# EAGLE design dot-reader (EAGLE 7.3.0)
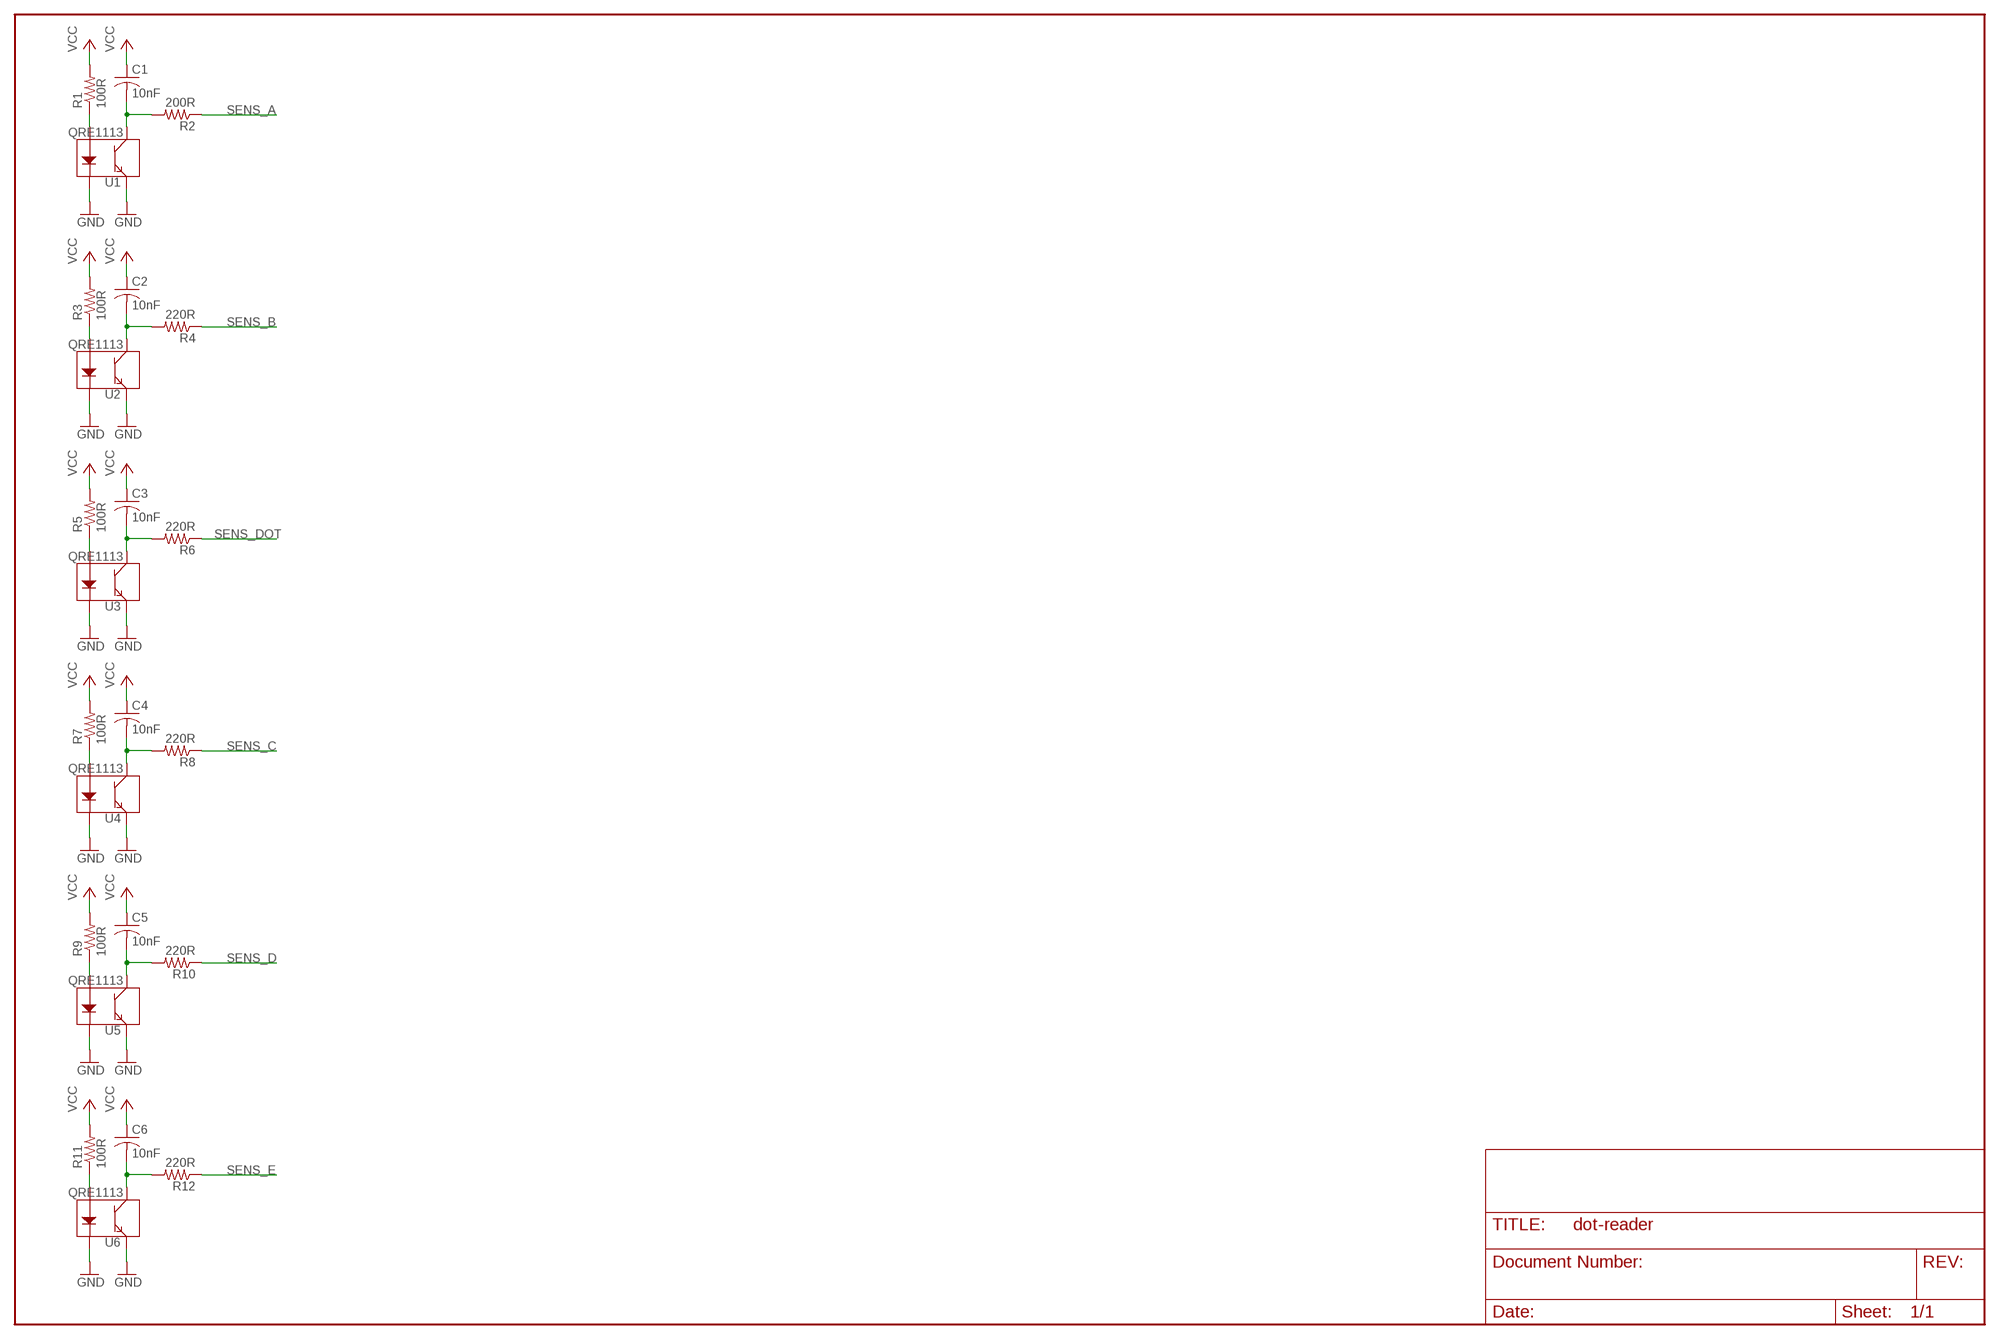
[diagram p0: schematic, sheet 1]

## Parts
C1  10nF  C-USC0805  [C0805]
C2  10nF  C-USC0805  [C0805]
C3  10nF  C-USC0805  [C0805]
C4  10nF  C-USC0805  [C0805]
C5  10nF  C-USC0805  [C0805]
C6  10nF  C-USC0805  [C0805]
R1  100R  R-US_M0805  [M0805]
R2  200R  R-US_M0805  [M0805]
R3  100R  R-US_M0805  [M0805]
R4  220R  R-US_M0805  [M0805]
R5  100R  R-US_M0805  [M0805]
R6  220R  R-US_M0805  [M0805]
R7  100R  R-US_M0805  [M0805]
R8  220R  R-US_M0805  [M0805]
R9  100R  R-US_M0805  [M0805]
R10  220R  R-US_M0805  [M0805]
R11  100R  R-US_M0805  [M0805]
R12  220R  R-US_M0805  [M0805]
U1  QRE1113  [QRE1113]
U2  QRE1113  [QRE1113]
U3  QRE1113  [QRE1113]
U4  QRE1113  [QRE1113]
U5  QRE1113  [QRE1113]
U6  QRE1113  [QRE1113]

## Nets
GND: U1.2(K) U1.4(E) U2.2(K) U2.4(E) U3.2(K) U3.4(E) U4.2(K) U4.4(E) U5.2(K) U5.4(E) U6.2(K) U6.4(E)
N$1: R1.1 U1.1(A)
N$2: C1.2 R2.2 U1.3(C)
N$3: R3.1 U2.1(A)
N$4: C2.2 R4.2 U2.3(C)
N$5: R5.1 U3.1(A)
N$6: C3.2 R6.2 U3.3(C)
N$7: R7.1 U4.1(A)
N$8: C4.2 R8.2 U4.3(C)
N$9: R9.1 U5.1(A)
N$10: C5.2 R10.2 U5.3(C)
N$11: R11.1 U6.1(A)
N$12: C6.2 R12.2 U6.3(C)
SENS_A: R2.1
SENS_B: R4.1
SENS_C: R8.1
SENS_D: R10.1
SENS_DOT: R6.1
SENS_E: R12.1
VCC: C1.1 C2.1 C3.1 C4.1 C5.1 C6.1 R1.2 R3.2 R5.2 R7.2 R9.2 R11.2

## Library data of the parts
C1-C6 = resistor:C-US: CAPACITOR, American symbol
R1-R12 = resistor:R-US_: RESISTOR, American symbol
U1-U6 = SparkFun-Sensors:QRE1113: Reflective object sensor; PROD_ID: IC-09357

## Board
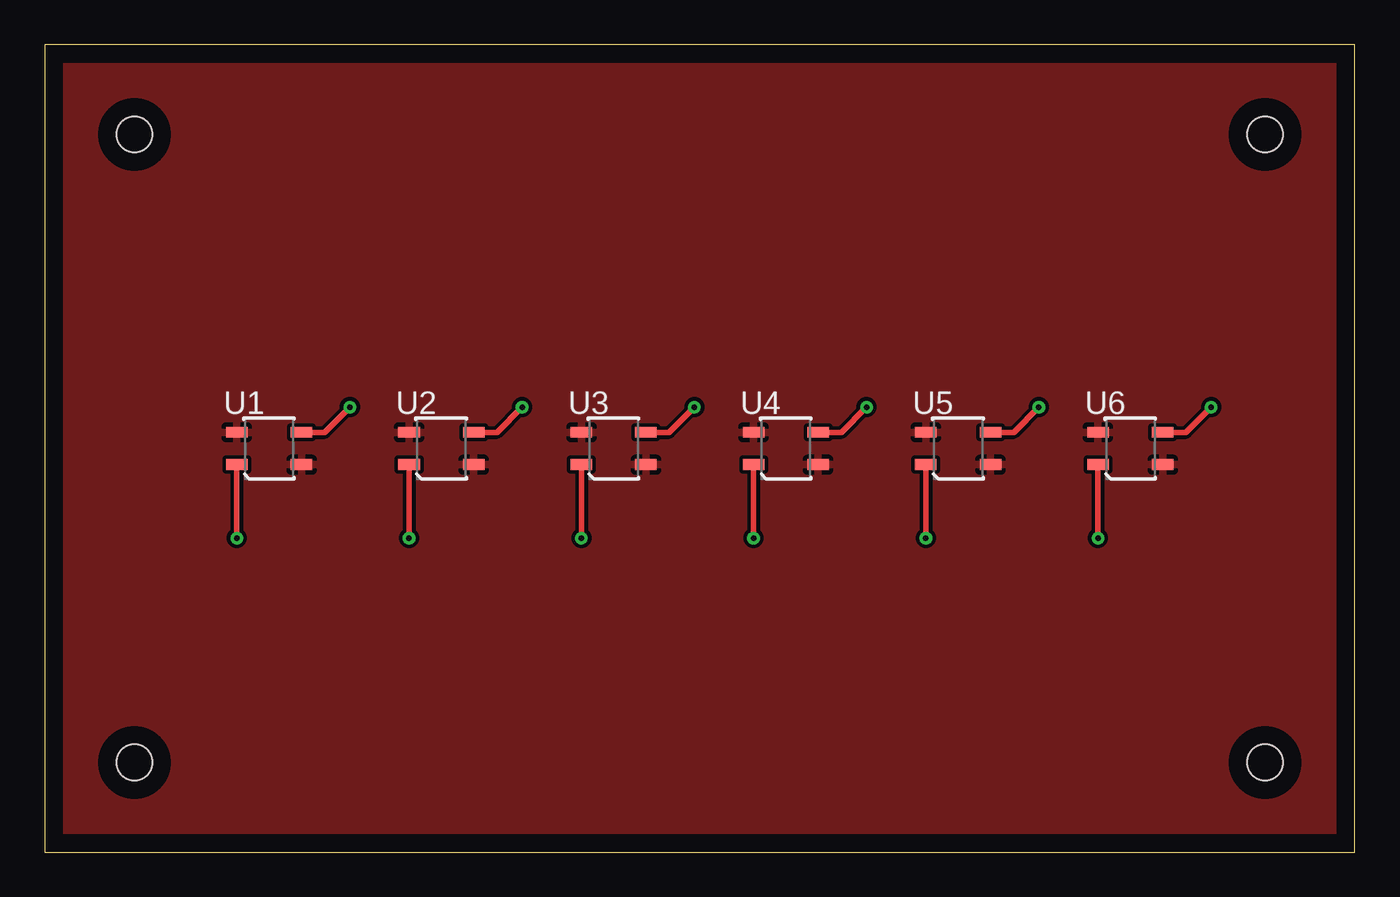
[diagram p1: board, top side]
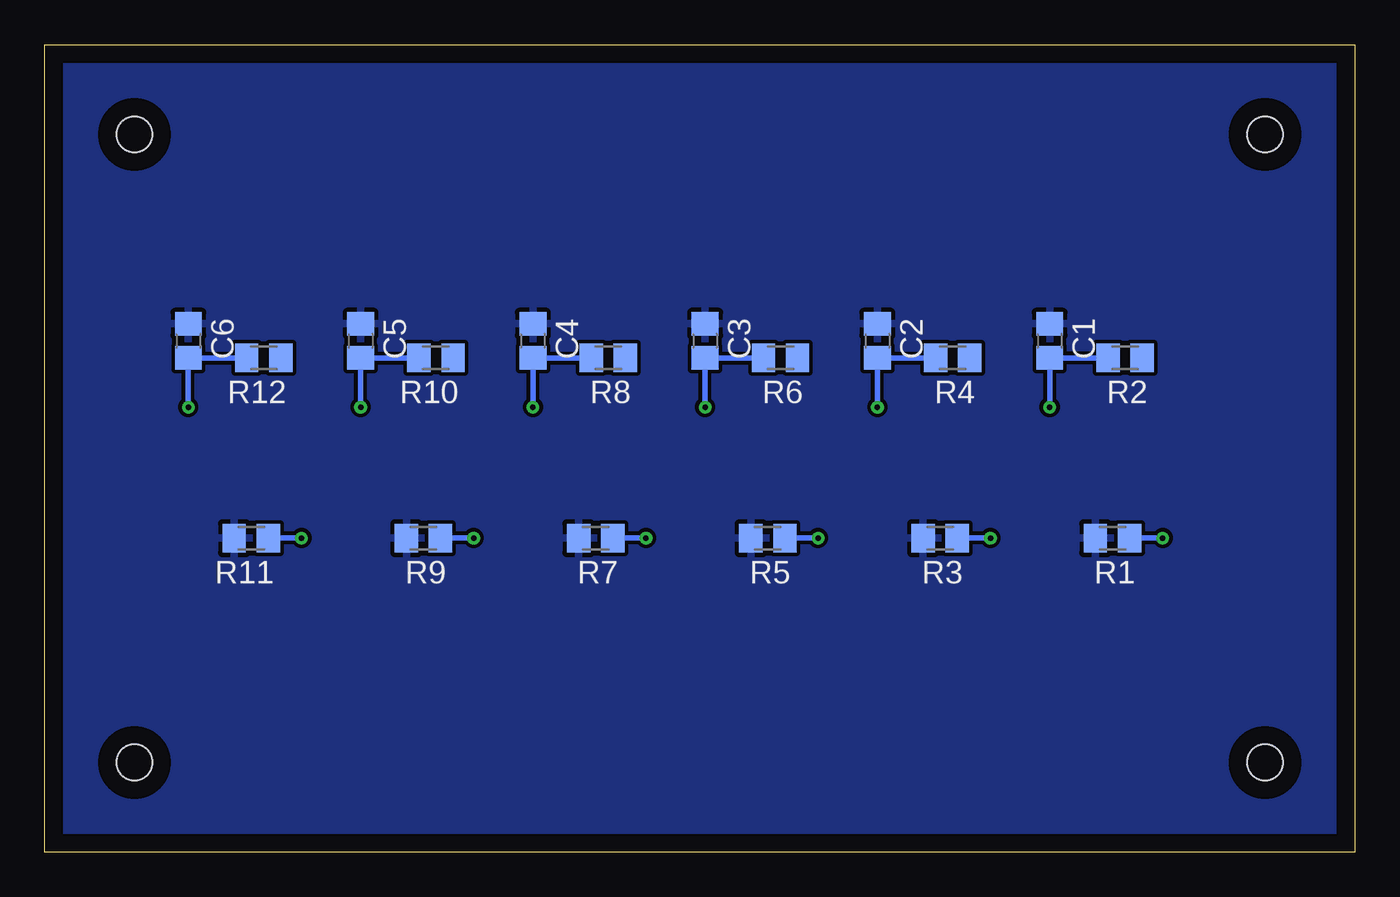
[diagram p2: board, bottom side, seen from below]

Size 73 x 45 mm. Coordinates in mm from the lower left corner, seen from the top.
Outline: 0,0 73,0 73,45 0,45 0,0
Copper layers (1*16): Top 0.035mm / dielectric 1.5mm / Bottom 0.035mm
Design rules "default": minimum track width 10mil, minimum drill 24mil, track to track 8mil, track to pad 8mil, pad to pad 8mil, via to via 8mil, smd to smd 8mil, copper to edge 40mil, drill to drill 8mil, minimum pad ring 10mil, minimum via ring 8mil, stop-mask expansion 4mil, vias tented up to drill 0mil, thermal gap 10mil
Holes 2 mm at 5,5 68,5 5,40 68,40

### Footprints (pad centres in the part's own frame; a part is rotated, then mirrored left to right if it is on the bottom)
C0805 = smd 1.3 x 1.5: 1 -0.95,0; 2 0.95,0
M0805 = smd 1.3 x 1.6: 1 -0.95,0; 2 0.95,0
QRE1113 = smd 1.2 x 0.6: 1 -1.8,-0.9; 2 1.8,-0.9; 3 1.8,0.9; 4 -1.8,0.9

### Placement (x,y rotation side)
C1  17,28.5 270 bottom
C2  26.6,28.5 270 bottom
C3  36.2,28.5 270 bottom
C4  45.8,28.5 270 bottom
C5  55.4,28.5 270 bottom
C6  65,28.5 270 bottom
R1  13.5,17.5 180 bottom
R2  12.8,27.55 180 bottom
R3  23.1,17.5 180 bottom
R4  22.4,27.55 180 bottom
R5  32.7,17.5 180 bottom
R6  32,27.55 180 bottom
R7  42.3,17.5 180 bottom
R8  41.6,27.55 180 bottom
R9  51.9,17.5 180 bottom
R10  51.2,27.55 180 bottom
R11  61.5,17.5 180 bottom
R12  60.8,27.55 180 bottom
U1  12.5,22.5 0 top
U2  22.1,22.5 0 top
U3  31.7,22.5 0 top
U4  41.3,22.5 0 top
U5  50.9,22.5 0 top
U6  60.5,22.5 0 top

### Tracks (layer width: path | path; a pad name or v marks a point on that pad's centre or on a via)
GND
  pour Top: 0,0 73,0 73,45 0,45
N$1  (via drill 0.3)
  Top 0.305: U1.1 v10.7,17.5
  Bottom 0.305: v10.7,17.5 R1.1
N$2  (via drill 0.3)
  Top 0.305: U1.3 15.6,23.4 v17,24.8
  Bottom 0.305: R2.2 C1.2 v17,24.8
N$3  (via drill 0.3)
  Top 0.305: U2.1 v20.3,17.5
  Bottom 0.305: v20.3,17.5 R3.1
N$4  (via drill 0.3)
  Top 0.305: U2.3 25.2,23.4 v26.6,24.8
  Bottom 0.305: v26.6,24.8 C2.2 R4.2
N$5  (via drill 0.3)
  Top 0.305: U3.1 v29.9,17.5
  Bottom 0.305: v29.9,17.5 R5.1
N$6  (via drill 0.3)
  Top 0.305: U3.3 34.8,23.4 v36.2,24.8
  Bottom 0.305: v36.2,24.8 C3.2 R6.2
N$7  (via drill 0.3)
  Top 0.305: U4.1 v39.5,17.5
  Bottom 0.305: v39.5,17.5 R7.1
N$8  (via drill 0.3)
  Top 0.305: U4.3 44.4,23.4 v45.8,24.8
  Bottom 0.305: R8.2 C4.2 v45.8,24.8
N$9  (via drill 0.3)
  Top 0.305: U5.1 v49.1,17.5
  Bottom 0.305: v49.1,17.5 R9.1
N$10  (via drill 0.3)
  Top 0.305: U5.3 54,23.4 v55.4,24.8
  Bottom 0.305: v55.4,24.8 C5.2 R10.2
N$11  (via drill 0.3)
  Top 0.305: U6.1 v58.7,17.5
  Bottom 0.305: v58.7,17.5 R11.1
N$12  (via drill 0.3)
  Top 0.305: U6.3 63.6,23.4 v65,24.8
  Bottom 0.305: v65,24.8 C6.2 R12.2
VCC
  pour Bottom: 0,0 73,0 73,45 0,45